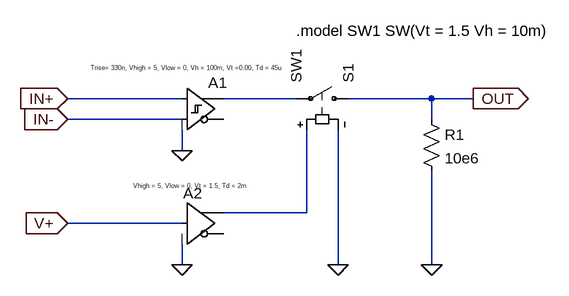
[diagram p0: schematic TLV1851DBVR.asc]
TLV1851DBVR.asc, the LTspice schematic file:
Version 4.1
SHEET 1 1016 1032
WIRE 192 192 16 192
WIRE 368 192 256 192
WIRE 576 192 448 192
WIRE 640 192 576 192
WIRE 192 224 16 224
WIRE 576 224 576 192
WIRE 192 272 192 240
WIRE 384 368 384 240
WIRE 384 368 256 368
WIRE 192 384 16 384
WIRE 192 448 192 416
WIRE 432 448 432 240
WIRE 576 448 576 304
FLAG 192 272 0
FLAG 16 384 V+
IOPIN 16 384 In
FLAG 16 192 IN+
IOPIN 16 192 In
FLAG 16 224 IN-
IOPIN 16 224 In
FLAG 640 192 OUT
IOPIN 640 192 Out
FLAG 192 448 0
FLAG 432 448 0
FLAG 576 448 0
SYMBOL Digital\\diffschmitt 192 144 R0
WINDOW 3 150 1 Right 0
SYMATTR Value Trise= 330n, Vhigh = 5, Vlow = 0, Vh = 100m, Vt =0.00, Td = 45u
SYMATTR InstName A1
SYMBOL sw 464 192 M270
SYMATTR InstName S1
SYMATTR Value SW1
SYMBOL Digital\\buf 192 320 R0
WINDOW 0 2 18 Left 2
WINDOW 3 -75 6 Left 0
SYMATTR InstName A2
SYMATTR Value Vhigh = 5, Vlow = 0, Vt = 1.5, Td = 2m
SYMBOL res 560 208 R0
SYMATTR InstName R1
SYMATTR Value 10e6
TEXT 368 88 Left 2 !.model SW1 SW(Vt = 1.5 Vh = 10m)

The netlist it stands for:
* TLV1851DBVR.asc
A1 IN+ IN- 0 0 0 0 N001 0 SCHMITT Trise= 330n, Vhigh = 5, Vlow = 0, Vh = 100m, Vt =0.00, Td = 45u
S1 OUT N001 N002 0 SW1
A2 V+ 0 0 0 0 0 N002 0 BUF Vhigh = 5, Vlow = 0, Vt = 1.5, Td = 2m
R1 OUT 0 10e6
.model SW1 SW(Vt = 1.5 Vh = 10m)
.backanno
.end